# EAGLE schematic FARv1 (EAGLE 9.6.2)
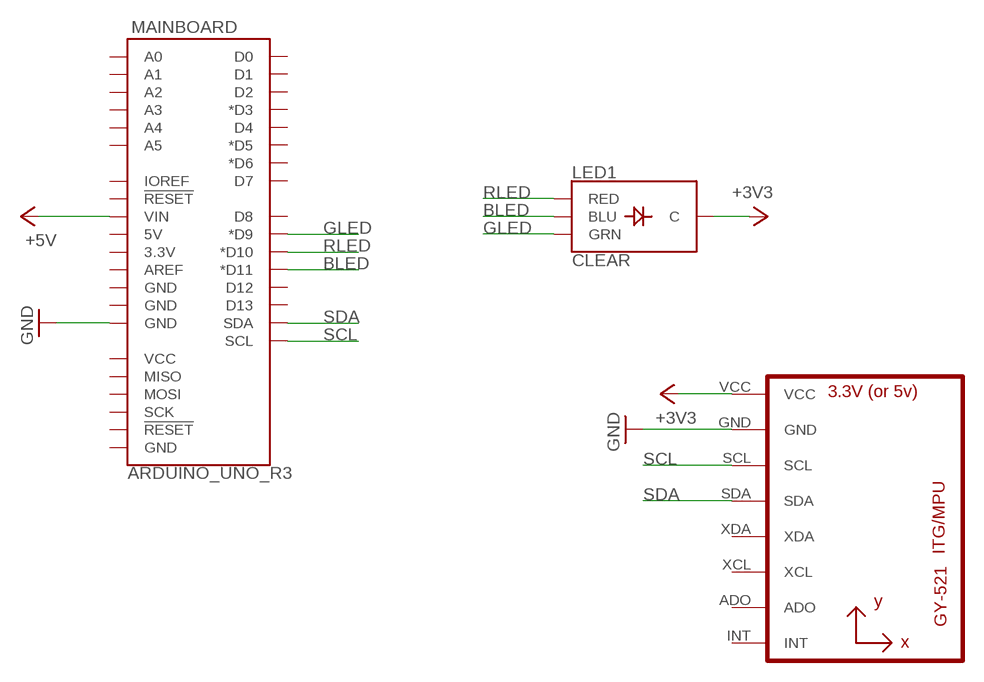
[diagram p0: schematic, sheet 1]

## Parts
LED1  CLEAR  LED-RGB-CCCLEAR  [LED-RGB-THRU]
MAINBOARD  ARDUINO_UNO_R3  [ARDUINO_R3]
U1  GY-521MPU6050  [GY-521]

## Nets
+3V3: LED1.2(C) U1.VCC
+5V: MAINBOARD.VIN
BLED: LED1.4(BLU) MAINBOARD.D11(*D11)
GLED: LED1.3(GRN) MAINBOARD.D9(*D9)
GND: MAINBOARD.GND@2(GND) U1.GND
RLED: LED1.1(RED) MAINBOARD.D10(*D10)
SCL: MAINBOARD.SCL U1.SCL
SDA: MAINBOARD.SDA U1.SDA
Unconnected: MAINBOARD.3.3V MAINBOARD.5V MAINBOARD.A0 MAINBOARD.A1 MAINBOARD.A2 MAINBOARD.A3 MAINBOARD.A4 MAINBOARD.A5 MAINBOARD.AREF MAINBOARD.D0 MAINBOARD.D1 MAINBOARD.D2 MAINBOARD.D3(*D3) MAINBOARD.D4 MAINBOARD.D5(*D5) MAINBOARD.D6(*D6) MAINBOARD.D7 MAINBOARD.D8 MAINBOARD.D12 MAINBOARD.D13 MAINBOARD.GND@1(GND) MAINBOARD.GND@3(GND) MAINBOARD.GND@4(GND) MAINBOARD.IOREF MAINBOARD.MISO MAINBOARD.MOSI MAINBOARD.RESET@1(!RESET!) MAINBOARD.RESET@2(!RESET!) MAINBOARD.SCK MAINBOARD.VCC U1.ADO U1.INT U1.XCL U1.XDA

## Library data of the parts
LED1 = SparkFun-LED:LED-RGB-CC: LED-RGB Common Cathode Packages: LED RGB-THRU LED_PIRANHA_5MM SparkFun Products: RGB Diffused Common Cathode- Diffuse <[https://www.sparkfun.com/products/9264]> RGB Diffused Common Cathode - Clear <[https://www.sparkfun.com/products/105]> LED-RGB 5mm Square (Piranha) <[https://www.sparkfun.com/products/11679]>; PROD_ID: DIO-08418
MAINBOARD = SparkFun-Boards:ARDUINO_UNO_R3: Arduino R3 Footprint with SPI header Arduino Uno R3 Compatible Footprint. Matches PCB size of the original board. SparkFun Products: SAMD21 Dev Breakout <https://www.sparkfun.com/products/13672> RedBoard <https://www.sparkfun.com/products/12757> R3 Stackable Headers <https://www.sparkfun.com/products/11417>
U1 = gy-521:GY-521